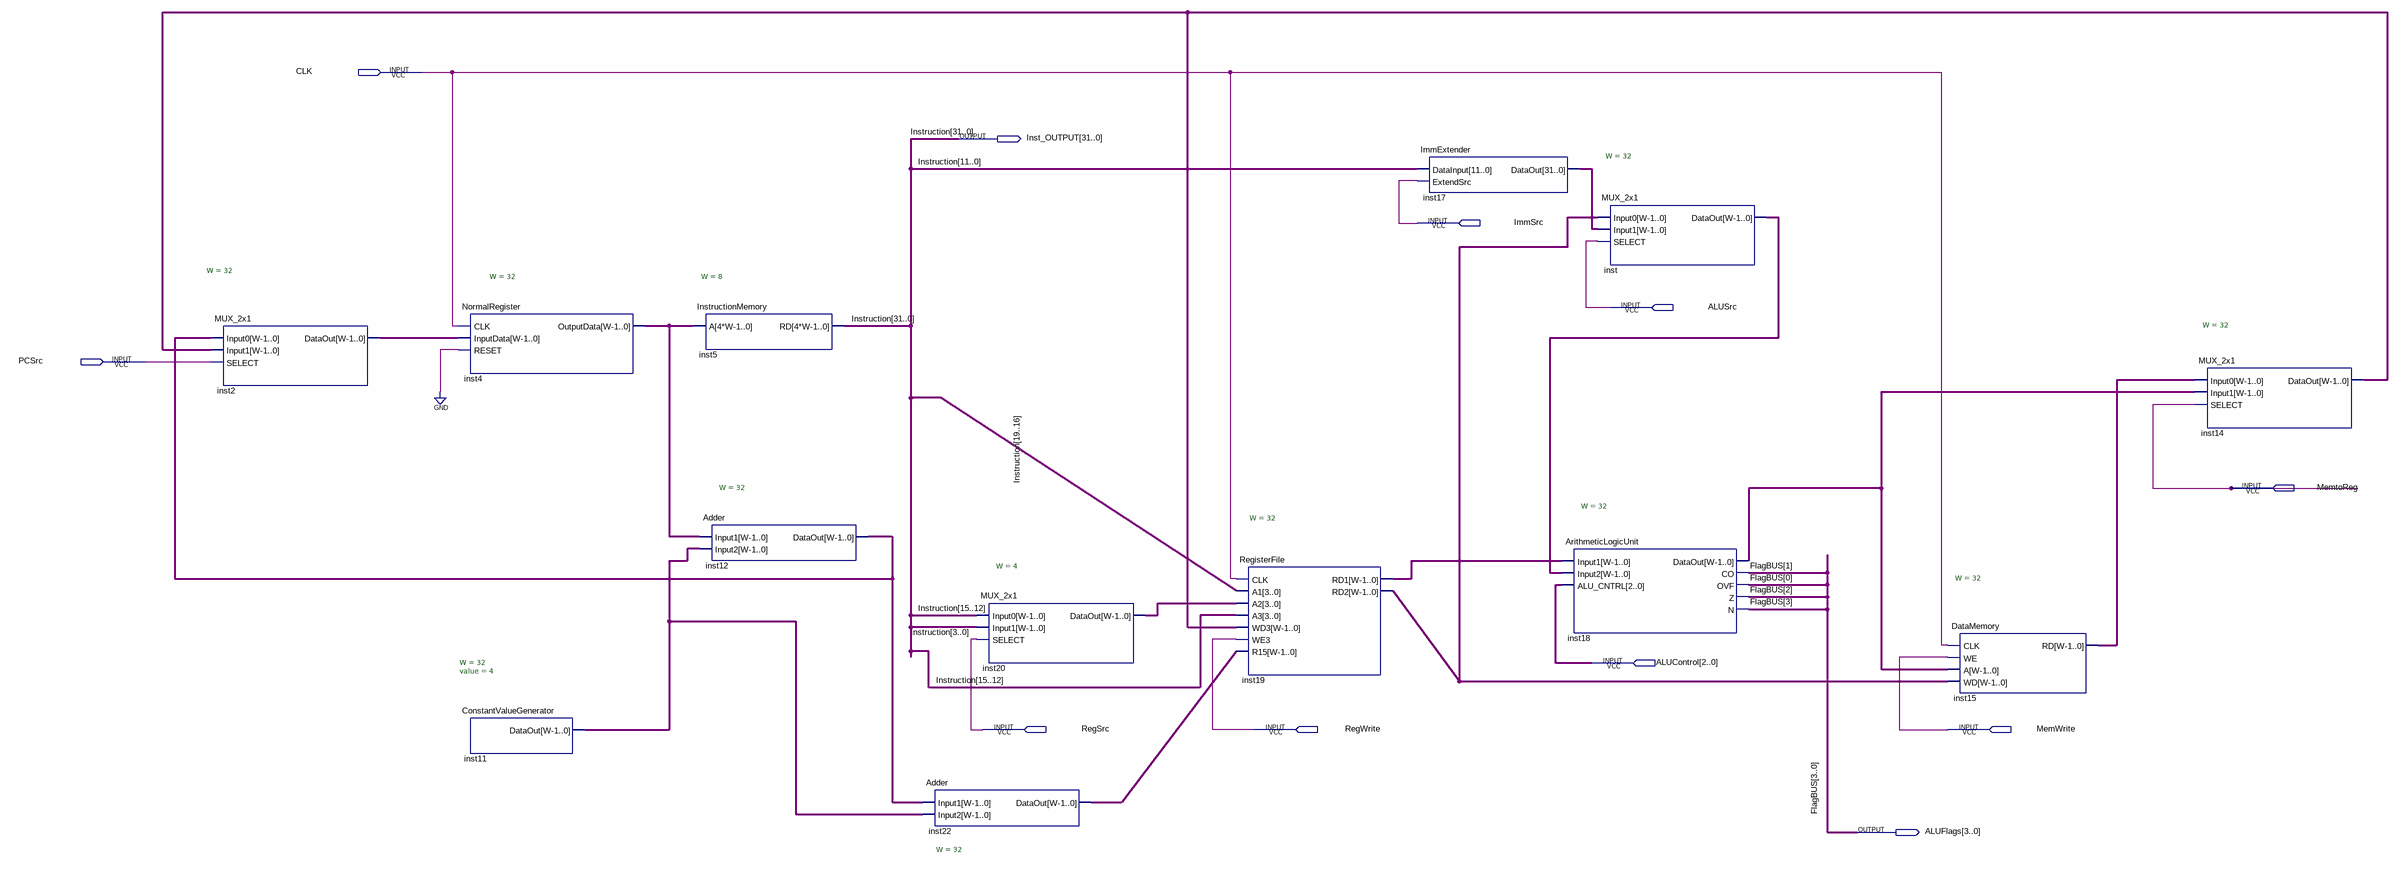
[diagram p0: schematic sheet]
// Quartus schematic DatapathDesign.bdf as structural Verilog: 13 symbols, 11 pins
module DatapathDesign (
  input  CLK,
  input  ImmSrc,
  input  ALUSrc,
  input  PCSrc,
  input  MemtoReg,
  input  [2:0] ALUControl,
  input  RegSrc,
  input  RegWrite,
  input  MemWrite,
  output [31:0] Inst_OUTPUT,
  output [3:0] ALUFlags
);

  wire [3:0] inst20_dataout;
  wire [31:0] inst2_dataout, inst4_outputdata, inst11_dataout, inst12_dataout, inst14_dataout, inst15_rd,
       inst17_dataout, inst18_dataout, inst19_rd1, inst19_rd2, inst22_dataout, inst_dataout;

  MUX_2x1 #(.W(32)) inst2 (.Input0(inst12_dataout), .Input1(inst14_dataout), .SELECT(PCSrc), .DataOut(inst2_dataout));
  NormalRegister #(.W(32)) inst4 (.CLK(CLK), .InputData(inst2_dataout), .RESET(1'b0), .OutputData(inst4_outputdata));
  ConstantValueGenerator #(.W(32), .value(4)) inst11 (.DataOut(inst11_dataout));
  InstructionMemory #(.W(8)) inst5 (.A(inst4_outputdata), .RD(Inst_OUTPUT));
  Adder #(.W(32)) inst12 (.Input1(inst4_outputdata), .Input2(inst11_dataout), .DataOut(inst12_dataout));
  Adder #(.W(32)) inst22 (.Input1(inst12_dataout), .Input2(inst11_dataout), .DataOut(inst22_dataout));
  MUX_2x1 #(.W(4)) inst20 (
    .Input0(Inst_OUTPUT[15:12]), .Input1(Inst_OUTPUT[3:0]), .SELECT(RegSrc), .DataOut(inst20_dataout));
  RegisterFile #(.W(32)) inst19 (
    .CLK(CLK), .A1(Inst_OUTPUT[19:16]), .A2(inst20_dataout), .A3(Inst_OUTPUT[15:12]), .WD3(inst14_dataout),
    .WE3(RegWrite), .R15(inst22_dataout), .RD1(inst19_rd1), .RD2(inst19_rd2));
  ImmExtender inst17 (.DataInput(Inst_OUTPUT[11:0]), .ExtendSrc(ImmSrc), .DataOut(inst17_dataout));
  ArithmeticLogicUnit #(.W(32)) inst18 (
    .Input1(inst19_rd1), .Input2(inst_dataout), .ALU_CNTRL(ALUControl), .DataOut(inst18_dataout),
    .CO(ALUFlags[1]), .OVF(ALUFlags[0]), .Z(ALUFlags[2]), .N(ALUFlags[3]));
  MUX_2x1 #(.W(32)) inst (.Input0(inst19_rd2), .Input1(inst17_dataout), .SELECT(ALUSrc), .DataOut(inst_dataout));
  DataMemory #(.W(32)) inst15 (.CLK(CLK), .WE(MemWrite), .A(inst18_dataout), .WD(inst19_rd2), .RD(inst15_rd));
  MUX_2x1 #(.W(32)) inst14 (.Input0(inst15_rd), .Input1(inst18_dataout), .SELECT(MemtoReg), .DataOut(inst14_dataout));

  // Other names for the same wires on the sheet: FlagBUS[3:0] = ALUFlags; Instruction[31:0] = Inst_OUTPUT
endmodule
